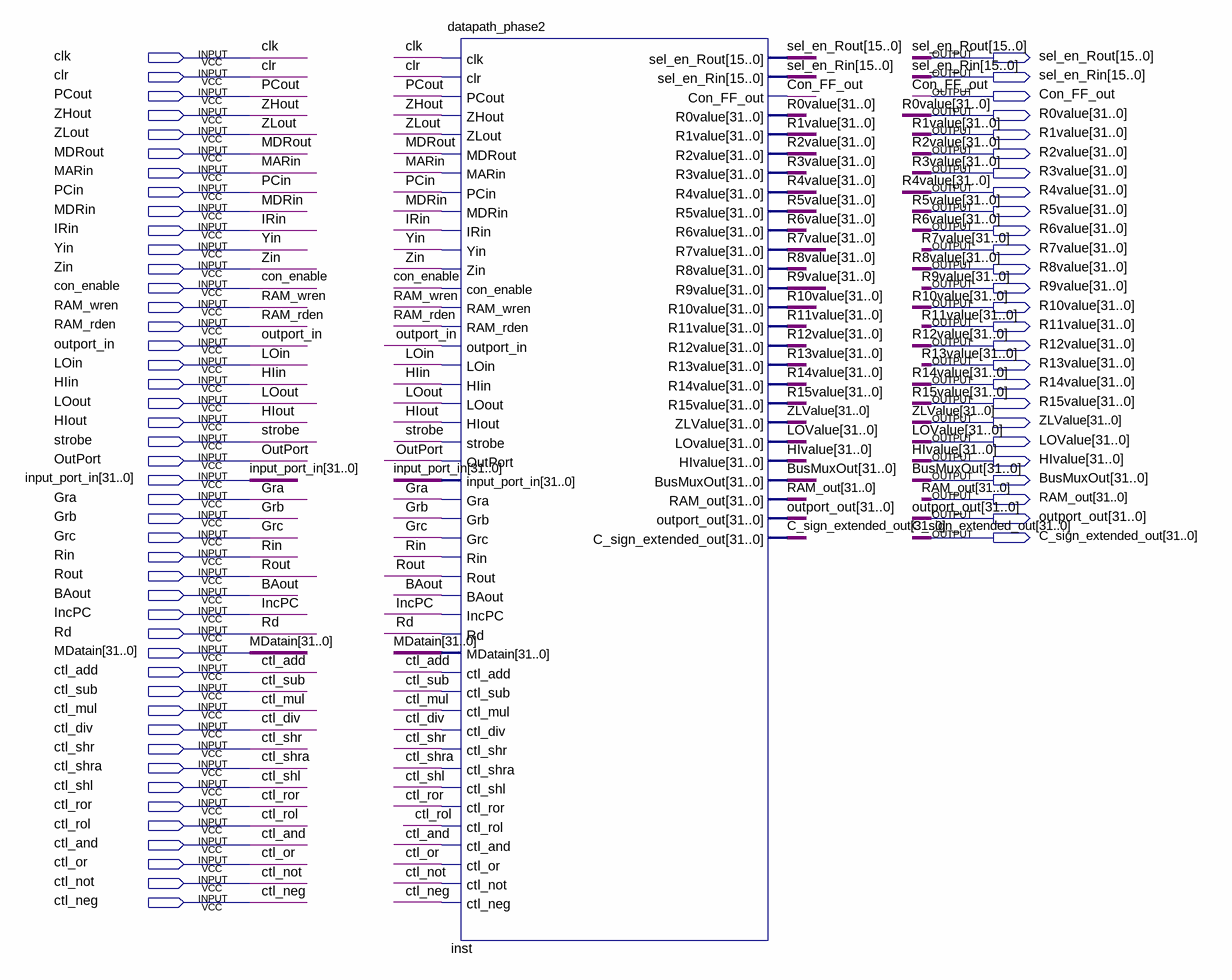
[diagram p0: schematic sheet]
// Quartus schematic phase2_schematic.bdf as structural Verilog: 1 symbols, 71 pins
module phase2_schematic (
  input  clk,
  input  clr,
  input  PCout,
  input  ZHout,
  input  ZLout,
  input  MDRout,
  input  MARin,
  input  PCin,
  input  MDRin,
  input  IRin,
  input  Yin,
  input  Zin,
  input  con_enable,
  input  RAM_wren,
  input  RAM_rden,
  input  outport_in,
  input  LOin,
  input  HIin,
  input  LOout,
  input  HIout,
  input  strobe,
  input  OutPort,
  input  [31:0] input_port_in,
  input  Gra,
  input  Grb,
  input  Grc,
  input  Rin,
  input  Rout,
  input  BAout,
  input  IncPC,
  input  Rd,
  input  [31:0] MDatain,
  input  ctl_add,
  input  ctl_sub,
  input  ctl_mul,
  input  ctl_div,
  input  ctl_shr,
  input  ctl_shra,
  input  ctl_shl,
  input  ctl_ror,
  input  ctl_rol,
  input  ctl_and,
  input  ctl_or,
  input  ctl_not,
  input  ctl_neg,
  output [15:0] sel_en_Rout,
  output [15:0] sel_en_Rin,
  output Con_FF_out,
  output [31:0] R0value,
  output [31:0] R1value,
  output [31:0] R2value,
  output [31:0] R3value,
  output [31:0] R4value,
  output [31:0] R5value,
  output [31:0] R6value,
  output [31:0] R7value,
  output [31:0] R8value,
  output [31:0] R9value,
  output [31:0] R10value,
  output [31:0] R11value,
  output [31:0] R12value,
  output [31:0] R13value,
  output [31:0] R14value,
  output [31:0] R15value,
  output [31:0] ZLValue,
  output [31:0] LOValue,
  output [31:0] HIvalue,
  output [31:0] BusMuxOut,
  output [31:0] RAM_out,
  output [31:0] outport_out,
  output [31:0] C_sign_extended_out
);

  datapath_phase2 inst (
    .clk(clk), .clr(clr), .PCout(PCout), .ZHout(ZHout), .ZLout(ZLout), .MDRout(MDRout), .MARin(MARin),
    .PCin(PCin), .MDRin(MDRin), .IRin(IRin), .Yin(Yin), .Zin(Zin), .con_enable(con_enable),
    .RAM_wren(RAM_wren), .RAM_rden(RAM_rden), .outport_in(outport_in), .LOin(LOin), .HIin(HIin),
    .LOout(LOout), .HIout(HIout), .strobe(strobe), .OutPort(OutPort), .input_port_in(input_port_in),
    .Gra(Gra), .Grb(Grb), .Grc(Grc), .Rin(Rin), .Rout(Rout), .BAout(BAout), .IncPC(IncPC), .Rd(Rd),
    .MDatain(MDatain), .ctl_add(ctl_add), .ctl_sub(ctl_sub), .ctl_mul(ctl_mul), .ctl_div(ctl_div),
    .ctl_shr(ctl_shr), .ctl_shra(ctl_shra), .ctl_shl(ctl_shl), .ctl_ror(ctl_ror), .ctl_rol(ctl_rol),
    .ctl_and(ctl_and), .ctl_or(ctl_or), .ctl_not(ctl_not), .ctl_neg(ctl_neg), .sel_en_Rout(sel_en_Rout),
    .sel_en_Rin(sel_en_Rin), .Con_FF_out(Con_FF_out), .R0value(R0value), .R1value(R1value),
    .R2value(R2value), .R3value(R3value), .R4value(R4value), .R5value(R5value), .R6value(R6value),
    .R7value(R7value), .R8value(R8value), .R9value(R9value), .R10value(R10value), .R11value(R11value),
    .R12value(R12value), .R13value(R13value), .R14value(R14value), .R15value(R15value), .ZLValue(ZLValue),
    .LOvalue(LOValue), .HIvalue(HIvalue), .BusMuxOut(BusMuxOut), .RAM_out(RAM_out),
    .outport_out(outport_out), .C_sign_extended_out(C_sign_extended_out));
endmodule
